# EAGLE design Voltmeter PCB RTC ESP_v3 (EAGLE 9.6.2)
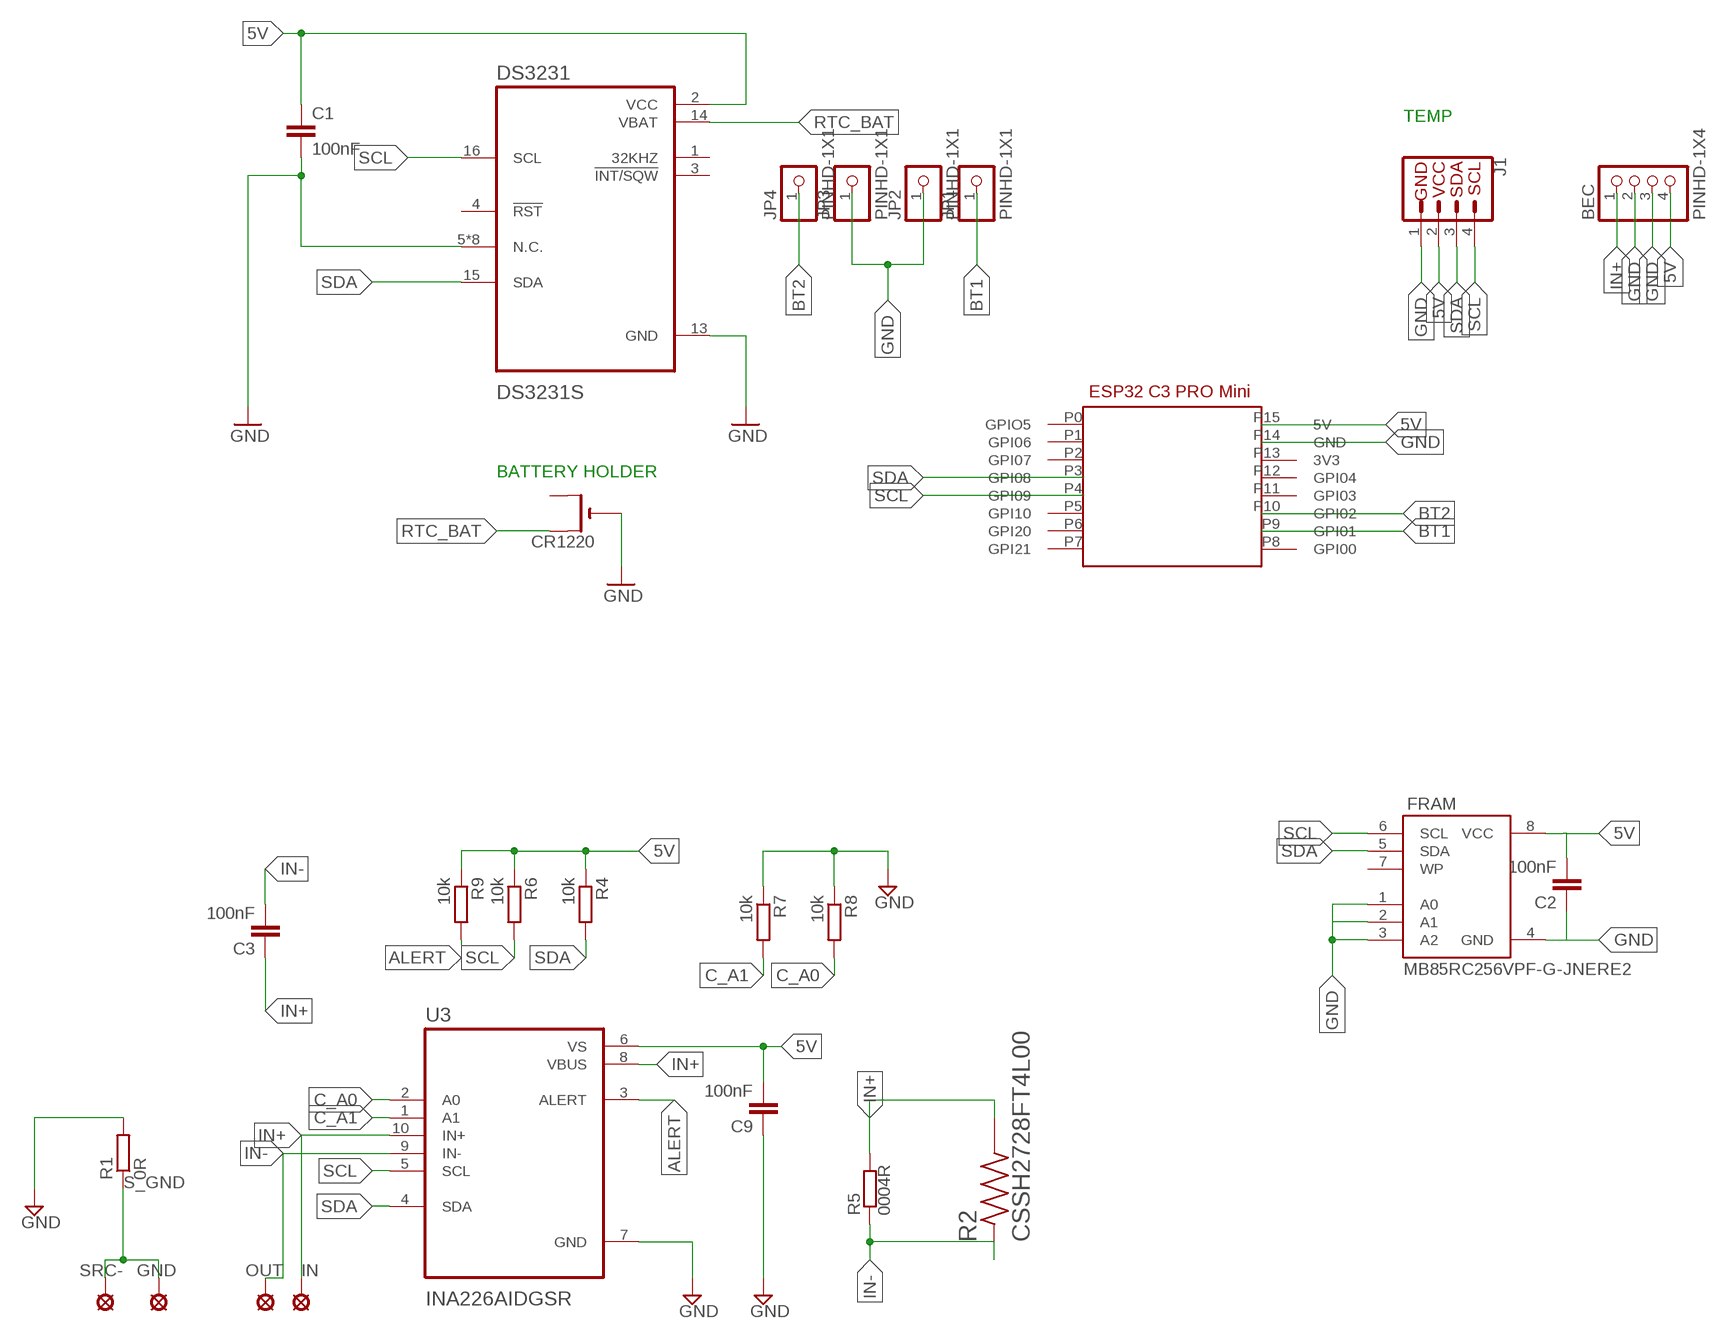
[diagram p0: schematic, sheet 1]

## Parts
BEC  PINHD-1X4  [1X04]
C1  100nF  C-EUC0603  [C0603]
C2  100nF  C-EUC0603  [C0603]
C3  100nF  C-EUC0603  [C0603]
C9  100nF  C-EUC0603  [C0603]
CR1220  CR1220SMT  [CR1220-SMD]
DS3231  DS3231S  [SOIC127P1032X265-16N]
FRAM  MB85RC256VPF-G-JNERE2  [SOIC8_208MIL]
GND  SE14  [SE14]
IN  SE14  [SE14]
J1  QWIIC_CONNECTORJS-1MM  [1X04_1MM_RA]
JP1  PINHD-1X1  [1X01]
JP2  PINHD-1X1  [1X01]
JP3  PINHD-1X1  [1X01]
JP4  PINHD-1X1  [1X01]
OUT  SE14  [SE14]
R1  0R  R-EU_R1206  [R1206]
R2  CSSH2728FT4L00  [RESC6771X124N]
R4  10k  R-EU_R0603  [R0603]
R5  0004R  BVS  [BVS]
R6  10k  R-EU_R0603  [R0603]
R7  10k  R-EU_R0603  [R0603]
R8  10k  R-EU_R0603  [R0603]
R9  10k  R-EU_R0603  [R0603]
SRC-  SE14  [SE14]
U3  INA226AIDGSR  [SOP50P490X110-10N]
U$1  ESP32_C3_PROV1  [ESP32_C2_PRO]

## Nets
5V: BEC.4 C1.1 C2.2 C9.2 DS3231.2(VCC) FRAM.8(VCC) J1.2(VCC) R4.1 R6.1 R9.1 U3.6(VS) U$1.P15(5V)
ALERT: R9.2 U3.3(ALERT)
BT1: JP1.1 U$1.P9(GPI01)
BT2: JP4.1 U$1.P10(GPI02)
C_A0: R8.2 U3.2(A0)
C_A1: R7.2 U3.1(A1)
GND: BEC.2 BEC.3 C1.2 C2.1 C9.1 CR1220.- DS3231.5(N.C.) DS3231.6(N.C.) DS3231.7(N.C.) DS3231.8(N.C.) DS3231.9(N.C.) DS3231.10(N.C.) DS3231.11(N.C.) DS3231.12(N.C.) DS3231.13(GND) FRAM.1(A0) FRAM.3(A2) FRAM.4(GND) J1.1(GND) JP2.1 JP3.1 R1.2 R7.1 R8.1 U3.7(GND) U$1.P14(GND)
IN+: BEC.1 C3.1 IN.MP R2.2 R5.1 U3.8(VBUS) U3.10(IN+)
IN-: C3.2 OUT.MP R2.1 R5.2 U3.9(IN-)
N$2: FRAM.2(A1)
RTC_BAT [medium]: CR1220.+$1(+) DS3231.14(VBAT)
S_GND [high_current]: GND.MP R1.1 SRC-.MP
SCL: DS3231.16(SCL) FRAM.6(SCL) J1.4(SCL) R6.2 U3.5(SCL) U$1.P4(GPI09)
SDA: DS3231.15(SDA) FRAM.5(SDA) J1.3(SDA) R4.2 U3.4(SDA) U$1.P3(GPI08)
Unconnected: CR1220.+$2(+1) DS3231.1(32KHZ) DS3231.3(!INT/SQW) DS3231.4(!RST) FRAM.7(WP) U$1.P0(GPIO5) U$1.P1(GPI06) U$1.P2(GPI07) U$1.P5(GPI10) U$1.P6(GPI20) U$1.P7(GPI21) U$1.P8(GPI00) U$1.P11(GPI03) U$1.P12(GPI04) U$1.P13(3V3)

## Notes on the sheet
- TEMP
- BATTERY HOLDER

## Library data of the parts
BEC = Connector:PINHD-1X4: PIN HEADER; CATEGORY: CONNECTOR; SUB-CATEGORY: PIN-HEADER
C1 = resistor:C-EU: CAPACITOR, European symbol
C2 C3 C9 = rcl:C-EU: CAPACITOR, European symbol; SPICEPREFIX: C
CR1220 = adafruit:CR1220: CR1216/CR1220/CR1225 12mm 3V lithium coin cell Great for battery packup. Both SMT and THM holders. Note the THM package has the ground pads on both sides of the PCB so that the masks are the same - this reduces the cost
DS3231 = DS3231S:DS3231S: Check prices <https://pricing.snapeda.com/parts/DS3231S/Maxim%20Integrated/view-part?ref=eda>; AVAILABILITY: Warning; DESCRIPTION: Real Time Clock (RTC) IC Clock/Calendar I²C, 2-Wire Serial 16-SOIC (0.295, 7.50mm Width); MF: Maxim Integrated; MP: DS3231S; PACKAGE: SOIC-16 Maxim Integrated; PRICE: None; PURCHASE-URL: https://pricing.snapeda.com/search/part/DS3231S/?ref=eda
FRAM = MB85RC256VPF-G-JNERE2:MB85RC256VPF-G-JNERE2: Check availability <https://pricing.snapeda.com/parts/MB85RC256VPFGJNERE2/Fujitsu%20Semiconductors/view-part?ref=eda>; AVAILABILITY: In Stock; CHECK_PRICES: https://www.snapeda.com/parts/MB85RC256VPFGJNERE2/Fujitsu/view-part/?ref=eda; DESCRIPTION: 256 K (32 K × 8) Bit I2C | IC FRAM 256K I2C 1MHZ 8SOP; MF: Fujitsu Semiconductors; MP: MB85RC256VPFGJNERE2; PACKAGE: None; PRICE: None; SNAPEDA_LINK: https://www.snapeda.com/parts/MB85RC256VPFGJNERE2/Fujitsu/view-part/?ref=snap
GND IN OUT SRC- = solpad:SE14: SOLDER PAD E1553, drill 1,4mm, distributor Buerklin, 07F820
J1 = SparkFun-Connectors:QWIIC_CONNECTOR: SparkFun I2C Standard Qwiic Connector An SMD 1mm pitch JST connector makes it easy and quick (get it? Qwiic?) to connect I2C devices to each other. The Qwiic system <http://www.sparkfun.com/qwiic> enables fast and solderless connection between popular platforms and various sensors and actuators. We carry 200mm <https://www.sparkfun.com/products/14204>, 100mm <https://www.sparkfun.com/products/14205>, 50mm <https://www.sparkfun.com/products/14206>, and breadboard friendly <https://www.sparkfun.com/products/14207> Qwiic cables. We also offer 10 pcs strips <https://www.sparkfun.com/products/14323> the SMD connectors.
JP1-JP4 = Connector:PINHD-1X1: PIN HEADER; CATEGORY: CONNECTOR; SUB-CATEGORY: PIN-HEADER
R1 R4 R6-R9 = rcl:R-EU_: RESISTOR, European symbol; SPICEPREFIX: R
R2 = CSSH2728FT4L00:CSSH2728FT4L00: Check availability <https://pricing.snapeda.com/parts/CSSH2728FT4L00/Stackpole%20Electronics%20Inc/view-part?ref=eda>; AVAILABILITY: In Stock; CHECK_PRICES: https://www.snapeda.com/parts/CSSH2728FT4L00/Stackpole+Electronics/view-part/?ref=eda; DESCRIPTION: 4 mOhms ±1% 4W Chip Resistor Wide 2827 (7067 Metric), 2728 Automotive AEC-Q200, Current Sense Metal Element; MF: Stackpole Electronics Inc; MP: CSSH2728FT4L00; PACKAGE: 6771 Stackpole; PRICE: None; SNAPEDA_LINK: https://www.snapeda.com/parts/CSSH2728FT4L00/Stackpole+Electronics/view-part/?ref=snap
R5 = resistor-shunt:BVS: SMD SHUNT RESISTOR; OC_FARNELL: unknown; OC_NEWARK: unknown
U3 = INA226AIDGSR:INA226AIDGSR: Check availability <https://pricing.snapeda.com/parts/INA226AIDGSR/Texas%20Instruments/view-part?ref=eda>; AVAILABILITY: In Stock; CHECK_PRICES: https://www.snapeda.com/parts/INA226AIDGSR/Texas+Instruments/view-part/?ref=eda; DESCRIPTION: 36V, 16-bit, ultra-precise i2c output current/voltage/power monitor w/alert; MF: Texas Instruments; MP: INA226AIDGSR; PACKAGE: VSSOP-10 Texas Instruments; PRICE: None; SNAPEDA_LINK: https://www.snapeda.com/parts/INA226AIDGSR/Texas+Instruments/view-part/?ref=snap
U$1 = albert:ESP32_C3_PRO

## Net classes
0 default: width 0.305 mm, drill 0.254 mm, clearance 0.381 mm
1 high_current: width 3 mm, drill 0.508 mm, clearance 0.9 mm
2 medium: width 0.381 mm, drill 0.3 mm, clearance 0.381 mm

## Board
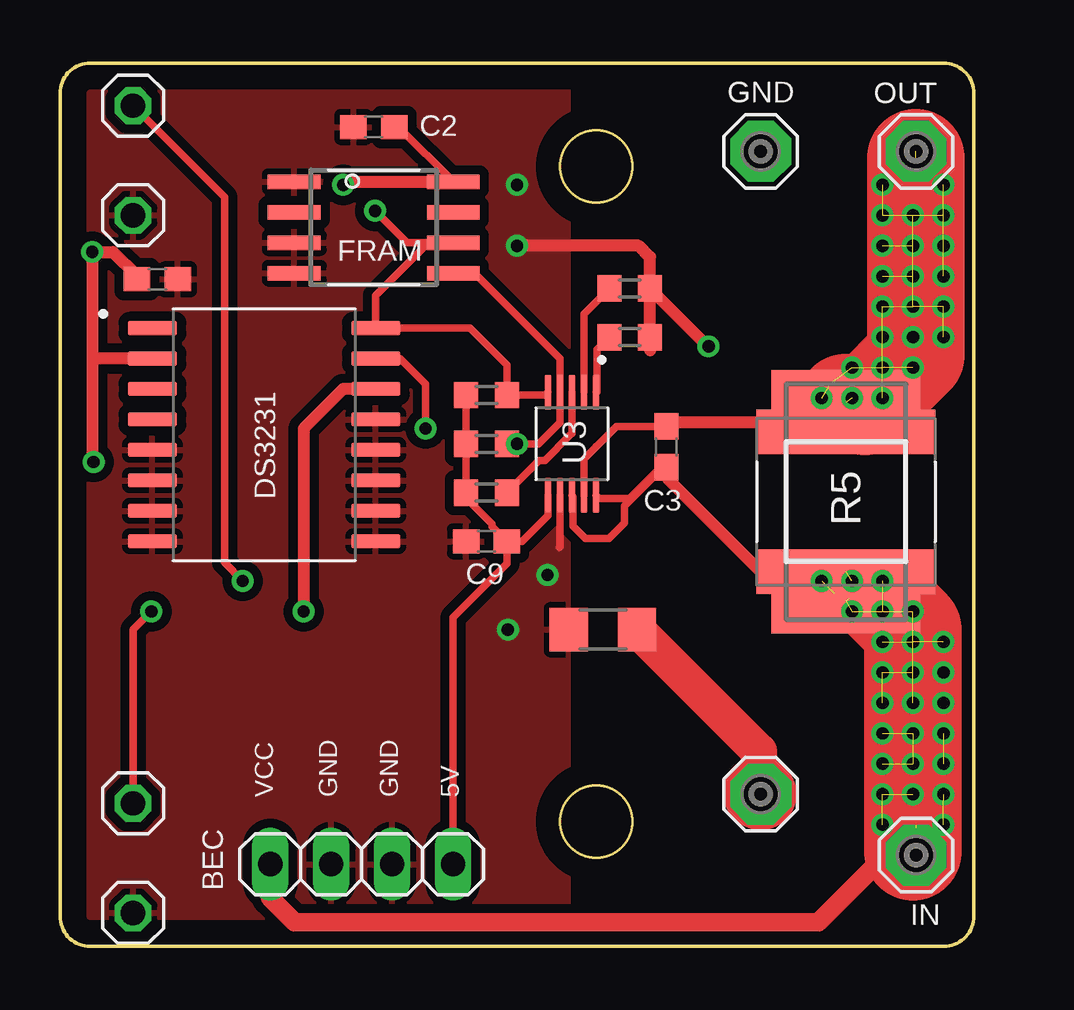
[diagram p1: board, top side]
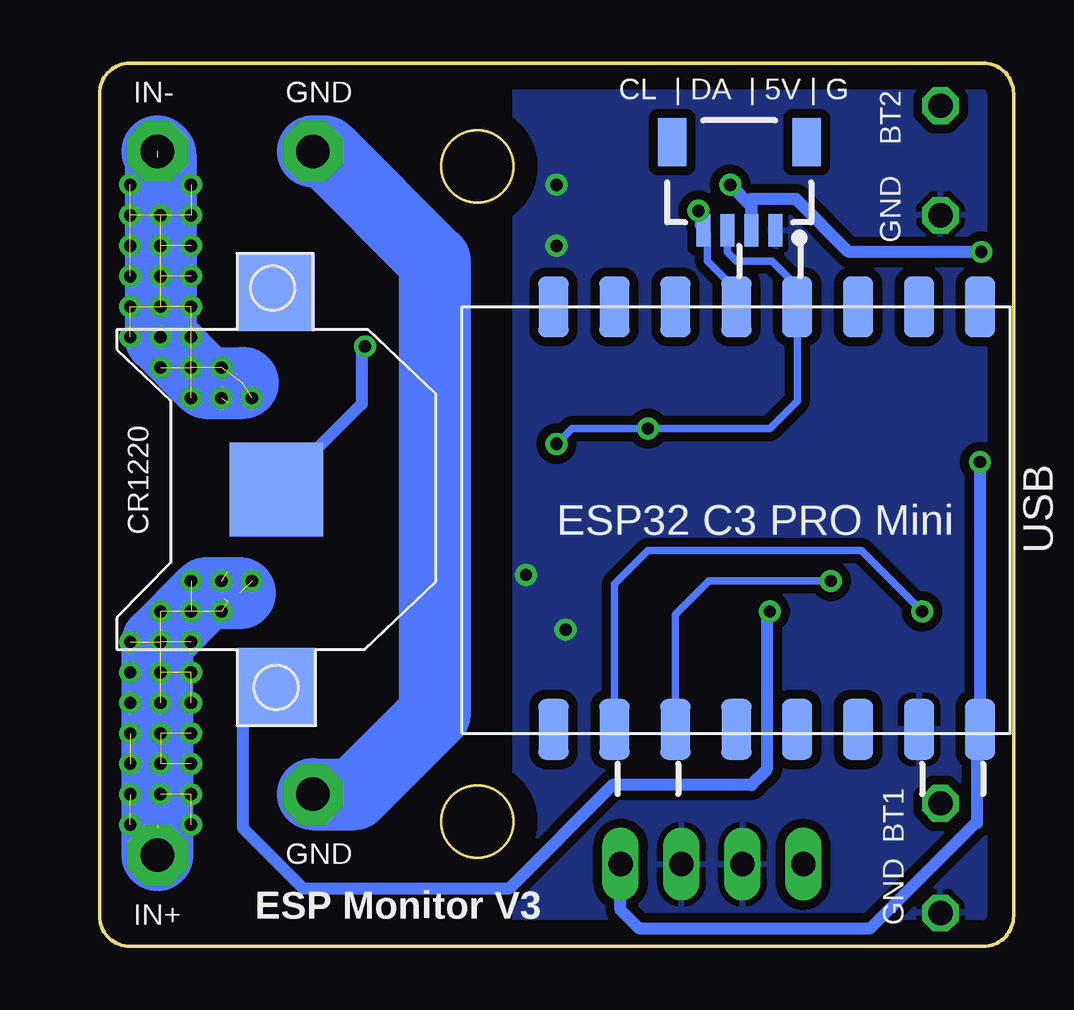
[diagram p2: board, bottom side, seen from below]

Size 38.1 x 36.83 mm. Coordinates in mm from the lower left corner, seen from the top.
Outline: 36.83,0 1.27,0 arc-90 0,1.27 0,35.56 arc-90 1.27,36.83 36.83,36.83 arc-90 38.1,35.56 38.1,1.27 arc-90 36.83,0
Outline: circle at 22.35,32.51 radius 1.5
Outline: circle at 22.35,5.21 radius 1.5
Copper layers (1*16): Top 0.035mm / dielectric 1.5mm / Bottom 0.035mm
Design rules "default *": minimum track width 10mil, minimum drill 0.35mm, track to track 9mil, track to pad 9mil, pad to pad 6mil, via to via 6mil, smd to smd 6mil, copper to edge 40mil, drill to drill 6mil, minimum pad ring 10mil, minimum via ring 8mil, stop-mask expansion 4mil, vias tented up to drill 100mil, thermal gap 10mil

### Footprints (pad centres in the part's own frame; a part is rotated, then mirrored left to right if it is on the bottom)
1X04 = drill 1.016 long: 1 -3.81,0; 2 -1.27,0; 3 1.27,0; 4 3.81,0
C0603 = smd 1.1 x 1: 1 -0.85,0; 2 0.85,0
CR1220-SMD = smd 3.2 x 3.2: +$1 -8.2,0; +$2 8.2,0 | smd 3.9 x 3.9: - 0,0
SOIC127P1032X265-16N = smd 2.05 x 0.59: 1 -4.655,4.445; 2 -4.655,3.175; 3 -4.655,1.905; 4 -4.655,0.635; 5 -4.655,-0.635; 6 -4.655,-1.905; 7 -4.655,-3.175; 8 -4.655,-4.445; 9 4.655,-4.445; 10 4.655,-3.175; 11 4.655,-1.905; 12 4.655,-0.635; 13 4.655,0.635; 14 4.655,1.905; 15 4.655,3.175; 16 4.655,4.445
SOIC8_208MIL = smd 0.6 x 2.2: 1 -1.905,-3.315; 2 -0.635,-3.315; 3 0.635,-3.315; 4 1.905,-3.315; 5 1.905,3.315; 6 0.635,3.315; 7 -0.635,3.315; 8 -1.905,3.315
SE14 = drill 1.397 pad 2.54 octagon: MP 0,0
1X04_1MM_RA = smd 0.6 x 1.35: 1 -1.5,0; 2 -0.5,0; 3 0.5,0; 4 1.5,0 | smd 1.2 x 2: NC1 2.8,-3.675; NC2 -2.8,-3.675
1X01 = drill 1.016 octagon: 1 0,0
R1206 = smd 1.6 x 1.803: 1 -1.422,0; 2 1.422,0
RESC6771X124N = smd 1.84 x 7.45: 1 -2.916,0; 2 2.916,0
R0603 = smd 1 x 1.1: 1 -0.85,0; 2 0.85,0
BVS = smd 2.7 x 6.2: 1 -4.14,0; 2 4.14,0
SOP50P490X110-10N = smd 1.47 x 0.28: 1 -2.15,1; 2 -2.15,0.5; 3 -2.15,0; 4 -2.15,-0.5; 5 -2.15,-1; 6 2.15,-1; 7 2.15,-0.5; 8 2.15,0; 9 2.15,0.5; 10 2.15,1
ESP32_C2_PRO = smd 2.54 x 1.27: P0 -2.54,19.05; P1 -2.54,16.51; P2 -2.54,13.97; P3 -2.54,11.43; P4 -2.54,8.89; P5 -2.54,6.35; P6 -2.54,3.81; P7 -2.54,1.27; P8 15.08,1.27; P9 15.08,3.81; P10 15.08,6.35; P11 15.08,8.89; P12 15.08,11.43; P13 15.08,13.97; P14 15.08,16.51; P15 15.08,19.05

### Placement (x,y rotation side)
BEC  12.57,3.43 0 top
C1  4.06,27.81 0 top
C2  13.08,34.16 0 top
C3  25.27,20.83 90 top
C9  17.78,16.89 0 top
CR1220  30.73,19.05 90 bottom
DS3231  8.51,21.34 0 top
FRAM  13.08,29.97 270 top
GND  29.21,33.15 0 top
IN  35.69,3.81 90 top
J1  11.43,29.84 180 bottom
JP1  3.05,5.97 0 top
JP2  3.05,1.4 0 top
JP3  3.05,30.48 0 top
JP4  3.05,35.05 0 top
OUT  35.69,33.15 0 top
R1  22.63,13.21 180 top
R2  32.77,18.54 270 top
R4  17.78,20.95 0 top
R5  32.77,18.54 90 top
R6  17.78,22.99 0 top
R7  23.75,25.4 180 top
R8  23.75,27.43 180 top
R9  17.78,18.92 0 top
SRC-  29.21,6.35 0 top
U3  21.34,20.95 270 top
U$1  20.45,24.13 270 bottom

### Tracks (layer width: path | path; a pad name or v marks a point on that pad's centre or on a via)
5V  (via drill 0.51)
  Top 0.305: U3.6 20.34,17.96 19.27,16.89 C9.2 | C9.2 18.63,15.96 16.38,13.72 BEC.4 | C2.2 14.11,34.16 FRAM.8 | C9.2 18.01,17.51 18.01,17.61 16.93,18.7 R9.1 R4.1 R6.1
  Top 0.508: 1.35,24.51 v1.35,28.96 2.2,28.96 3.21,27.94 C1.1 | 1.35,24.51 1.35,20.24 v1.4,20.19 | DS3231.2 1.35,24.51 | v11.81,31.75 11.94,31.88 FRAM.8
  Bottom 0.508: BEC.4 16.38,1.52 15.62,0.76 5.97,0.76 1.58,5.15 1.52,5.15 1.52,8.92 U$1.P15 v1.4,20.19 | v1.35,28.96 6.86,28.96 9.06,31.16 10.93,31.16 J1.2 10.93,30.87 v11.81,31.75
ALERT
  Top 0.305: R9.2 19.98,20.27 20.22,20.27 21.25,21.3 21.34,21.38 U3.3
BT1  (via drill 0.51)
  Top 0.305: v3.81,13.97 3.05,13.21 JP1.1
  Bottom 0.305: U$1.P9 16.64,15.11 15.24,16.51 6.35,16.51 v3.81,13.97
BT2  (via drill 0.51)
  Top 0.305: JP4.1 6.86,31.24 6.86,16 v7.62,15.24
  Bottom 0.305: v7.62,15.24 12.7,15.24 14.1,13.84 U$1.P10
C_A0
  Top 0.305: U3.2 21.84,26.37 R8.2
C_A1
  Top 0.305: R7.2 22.38,24.88 22.38,23.11 U3.1
GND  (via drill 0.51)
  Top 0.305: U3.7 20.84,16.64 20.83,16.64
  Top 0.508: R8.1 R7.1 24.6,24.84 | R8.1 24.6,28.74 24.13,29.21 v19.05,29.21 | v27.04,25.02 27.01,25.02 R8.1
  Bottom 0.508: CR1220.- 27.18,22.61 27.18,24.88 v27.04,25.02
  other vias: 19.05,31.75 20.32,15.49 18.67,13.21
  pour Top: -2.54,39.37 -2.54,-2.54 21.21,-2.54 21.21,39.37
  pour Bottom: -2.54,39.37 -2.54,-5.08 20.83,-5.08 20.83,39.37
IN+  (via drill 0.51)  (23 unrouted)
  Top 0.305: C3.1 25.15,19.98 23.53,18.36 23.53,17.66 22.89,17.02 21.91,17.02 21.39,17.53 21.39,18.75 U3.8 | U3.10 22.47,18.67 23.75,18.67 24.89,19.81 25.27,19.81 25.27,19.43 29.34,15.37 32,15.37 35.94,11.43 v36.83,11.43 v36.83,10.16 v36.83,7.62 | 35.69,4.95 IN.MP 35.56,3.94 | 35.69,5.08 34.29,6.48 | v36.83,7.62 v35.56,6.35 v35.56,7.62 | 36.83,6.1 v36.83,7.62
  Top 0.508: v31.75,15.24 29.59,15.24 25.39,19.44 25.4,19.44 25.4,19.85 C3.1
  Top 0.762: BEC.1 8.76,2.03 9.78,1.02 31.62,1.02 34.29,3.68 34.29,6.48
  Top 1.27: 34.29,14.48 32.89,14.48 | R2.2 R5.1 32.62,14.37 v31.75,15.24
  Top 4.064: 34.29,14.48 35.56,13.21 v35.56,7.62 35.56,3.94
  Bottom 3: IN.MP 35.69,12.7 33.66,14.73 32.26,14.73
  other vias: 36.83,6.35 34.29,6.35 34.29,7.62 34.29,8.89 34.29,10.16 34.29,11.43 34.29,12.7 33.02,13.97 35.56,8.89 35.56,10.16 35.56,11.43 35.56,12.7 36.83,8.89 36.83,12.7 35.56,13.97 34.29,15.24 34.29,13.97 33.02,15.24 34.29,5.08 36.83,5.08
IN-  (via drill 0.51)  (23 unrouted)
  Top 0.305: 22.35,20.82 22.34,20.84 | 22.35,20.82 23.2,21.68 C3.2 25.43,21.84 29.21,21.84 | U3.9 21.84,20.31 22.35,20.82
  Top 0.508: 31.5,21.84 29.21,21.84 25.51,21.84
  Top 1.27: 31.5,21.84 31.5,22.68 R5.2 32.88,22.56 33.55,22.51 | 34.07,23.02 31.71,21.62 31.88,21.46 R2.1 32.77,21.59 32.51,21.84
  Top 4.064: 34.07,23.02 33.55,22.51 | R5.2 33.73,22.68 35.69,24.64 35.69,32.89
  Bottom 3: OUT.MP 35.56,33.02 v35.56,25.4 33.66,23.5 32.13,23.5
  other vias: 36.83,25.4 36.83,26.67 34.29,26.67 34.29,27.94 35.56,26.67 35.56,27.94 35.56,29.21 35.56,30.48 35.56,24.13 34.29,22.86 34.29,24.13 33.02,24.13 31.75,22.86 34.29,29.21 34.29,30.48 36.83,27.94 36.83,29.21 36.83,30.48 34.29,25.4 34.29,31.75 33.02,22.86 36.83,31.75
RTC_BAT  (via drill 0.51)
  Top 0.508: DS3231.14 11.81,23.24 10.16,21.59 v10.16,13.97
  Bottom 0.508: v10.16,13.97 10.29,13.84 10.29,7.37 10.92,6.73 16.72,6.73 21.04,2.41 29.59,2.41 32.13,4.95 32.13,9.45 CR1220.+$1
S_GND
  Top 1.524: R1.1 29.13,8.13 29.13,6.43
  Top 3: SRC-.MP 29.13,6.43
  Bottom 3: GND.MP 28.7,33.15 24.13,28.57 24.13,9.7 27.48,6.35 SRC-.MP
SCL  (via drill 0.51)
  Top 0.305: U3.5 20.22,22.99 R6.2 18.63,24.23 17.08,25.78 DS3231.16 13.16,27.13 15.24,29.21 16.27,29.21 FRAM.6 14.47,29.34 v13.14,30.67
  Bottom 0.305: U$1.P4 11.56,27.36 12.76,28.57 12.76,29.68 J1.4 13.14,30.06 v13.14,30.67
SDA  (via drill 0.51)
  Top 0.305: R4.2 v19.05,20.95 19.94,20.95 20.84,21.85 U3.4 20.84,24.5 17.27,28.07 FRAM.5 | DS3231.15 14.18,24.51 15.24,23.45 v15.24,21.59
  Bottom 0.305: J1.3 11.93,28.96 11.55,28.57 10.07,28.57 9.02,27.52 U$1.P3 9.02,22.73 10.16,21.59 v15.24,21.59 18.41,21.59 v19.05,20.95

### Text on the board
tNames: VCC | GND | GND | 5V
bNames: CL | DA | 5V | G | BT2 | GND | IN- | GND | BT1 | GND | GND | ESP Monitor V3 | IN+